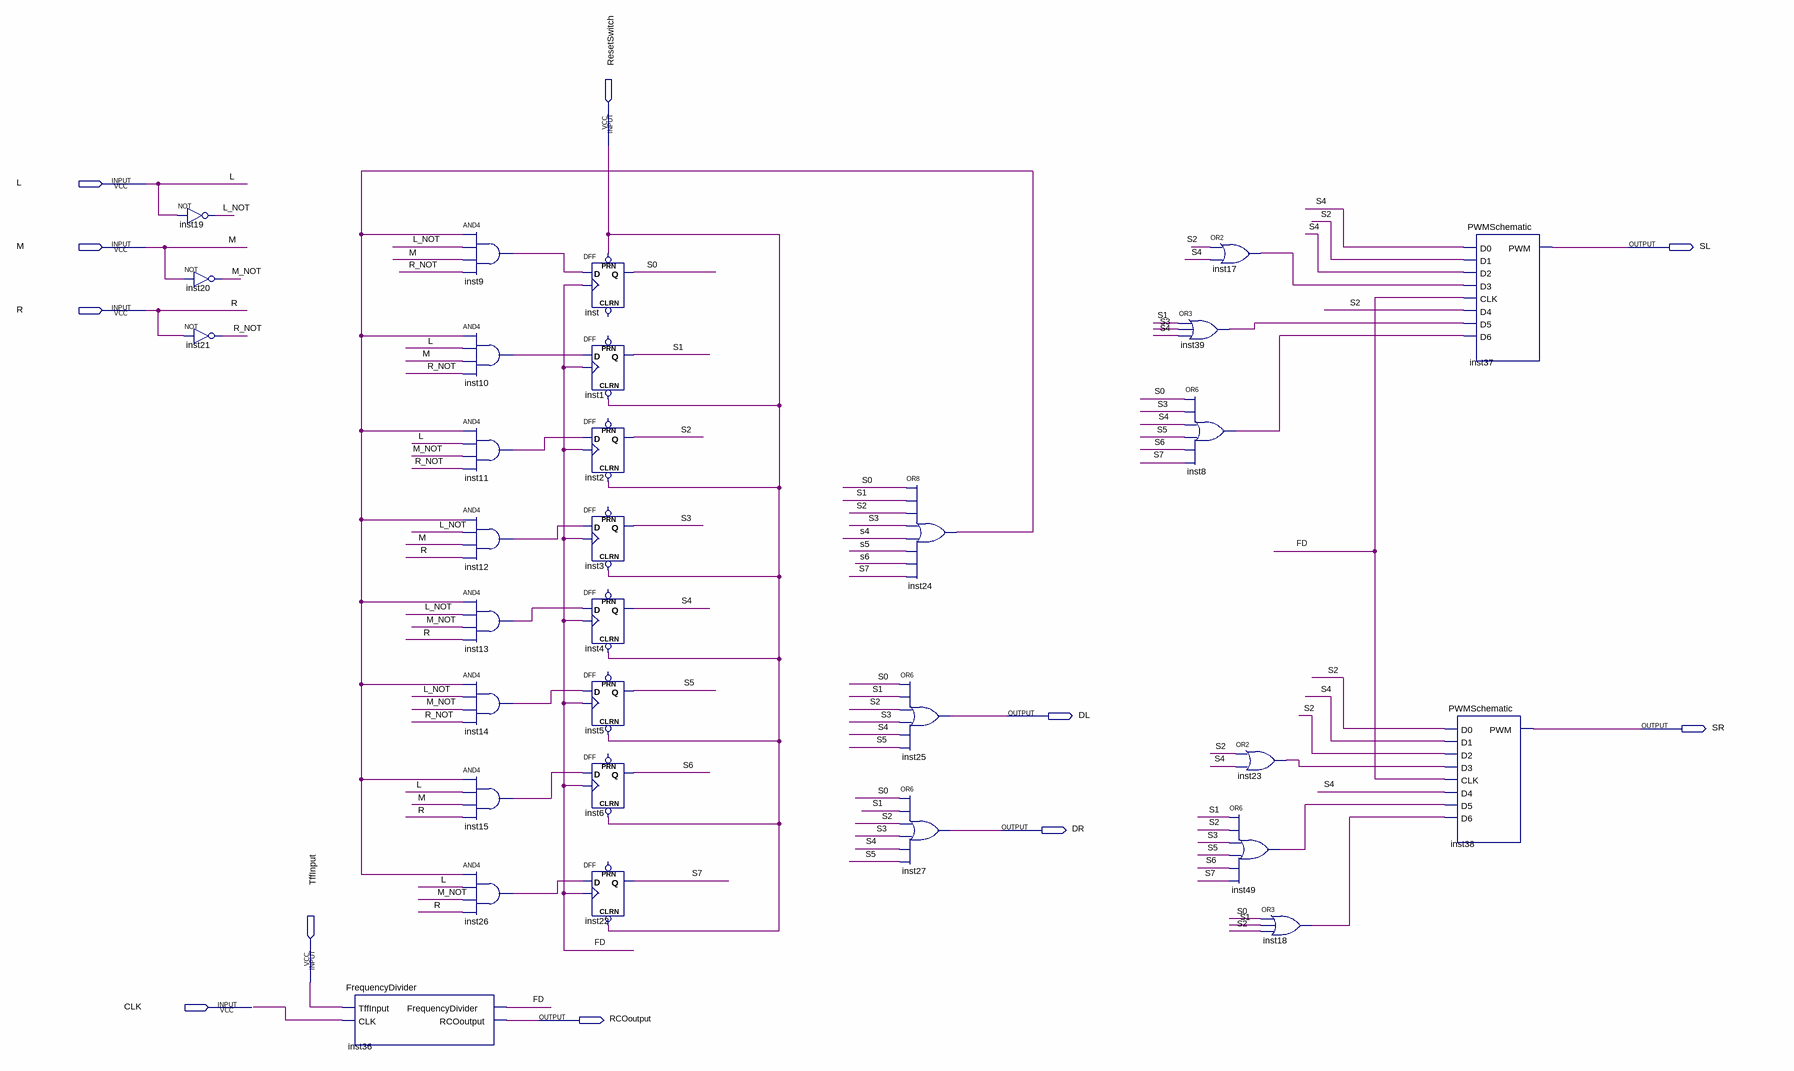
[diagram p0: schematic sheet]
// Quartus schematic ProjectStateMachine.bdf as structural Verilog: 31 symbols, 11 pins
module ProjectStateMachine (
  input  ResetSwitch,
  input  L,
  input  M,
  input  R,
  input  TffInput,
  input  CLK,
  output SL,
  output DL,
  output SR,
  output DR,
  output RCOoutput
);

  wire FD, inst8_out, inst9_out, inst10_out, inst11_out, inst12_out, inst13_out, inst14_out, inst15_out,
       inst17_out, inst18_out, inst23_out, inst24_out, inst26_out, inst39_out, inst49_out, L_NOT, M_NOT,
       R_NOT, S0, S1, S2, S3, S4, S5, S6, S7;

  not inst19 (L_NOT, L);
  not inst20 (M_NOT, M);
  not inst21 (R_NOT, R);
  FrequencyDivider inst36 (.TffInput(TffInput), .CLK(CLK), .FrequencyDivider(FD), .RCOoutput(RCOoutput));
  and inst9 (inst9_out, inst24_out, L_NOT, M, R_NOT);
  and inst10 (inst10_out, inst24_out, L, M, R_NOT);
  and inst11 (inst11_out, inst24_out, L, M_NOT, R_NOT);
  and inst12 (inst12_out, inst24_out, L_NOT, M, R);
  and inst13 (inst13_out, inst24_out, L_NOT, M_NOT, R);
  and inst14 (inst14_out, inst24_out, L_NOT, M_NOT, R_NOT);
  and inst15 (inst15_out, inst24_out, L, M, R);
  and inst26 (inst26_out, inst24_out, L, M_NOT, R);
  DFF inst (.CLK(FD), .D(inst9_out), .PRN(ResetSwitch), .Q(S0));  // open: CLRN
  DFF inst1 (.CLRN(ResetSwitch), .CLK(FD), .D(inst10_out), .Q(S1));  // open: PRN
  DFF inst2 (.CLRN(ResetSwitch), .CLK(FD), .D(inst11_out), .Q(S2));  // open: PRN
  DFF inst3 (.CLRN(ResetSwitch), .CLK(FD), .D(inst12_out), .Q(S3));  // open: PRN
  DFF inst4 (.CLRN(ResetSwitch), .CLK(FD), .D(inst13_out), .Q(S4));  // open: PRN
  DFF inst5 (.CLRN(ResetSwitch), .CLK(FD), .D(inst14_out), .Q(S5));  // open: PRN
  DFF inst6 (.CLRN(ResetSwitch), .CLK(FD), .D(inst15_out), .Q(S6));  // open: PRN
  DFF inst22 (.CLRN(ResetSwitch), .CLK(FD), .D(inst26_out), .Q(S7));  // open: PRN
  or inst24 (inst24_out, S0, S1, S2, S3, S4, S5, S6, S7);
  or inst25 (DL, S0, S1, S2, S3, S4, S5);
  or inst27 (DR, S0, S1, S2, S3, S4, S5);
  or inst39 (inst39_out, S1, S3, S4);
  or inst17 (inst17_out, S2, S4);
  or inst8 (inst8_out, S0, S3, S4, S5, S6, S7);
  or inst49 (inst49_out, S1, S2, S3, S5, S6, S7);
  or inst23 (inst23_out, S2, S4);
  or inst18 (inst18_out, S0, S1, S2);
  PWMSchematic inst37 (
    .D0(S4), .D1(S2), .D2(S4), .D3(inst17_out), .CLK(FD), .D4(S2), .D5(inst39_out), .D6(inst8_out), .PWM(SL));
  PWMSchematic inst38 (
    .D0(S2), .D1(S4), .D2(S2), .D3(inst23_out), .CLK(FD), .D4(S4), .D5(inst49_out), .D6(inst18_out), .PWM(SR));
endmodule
